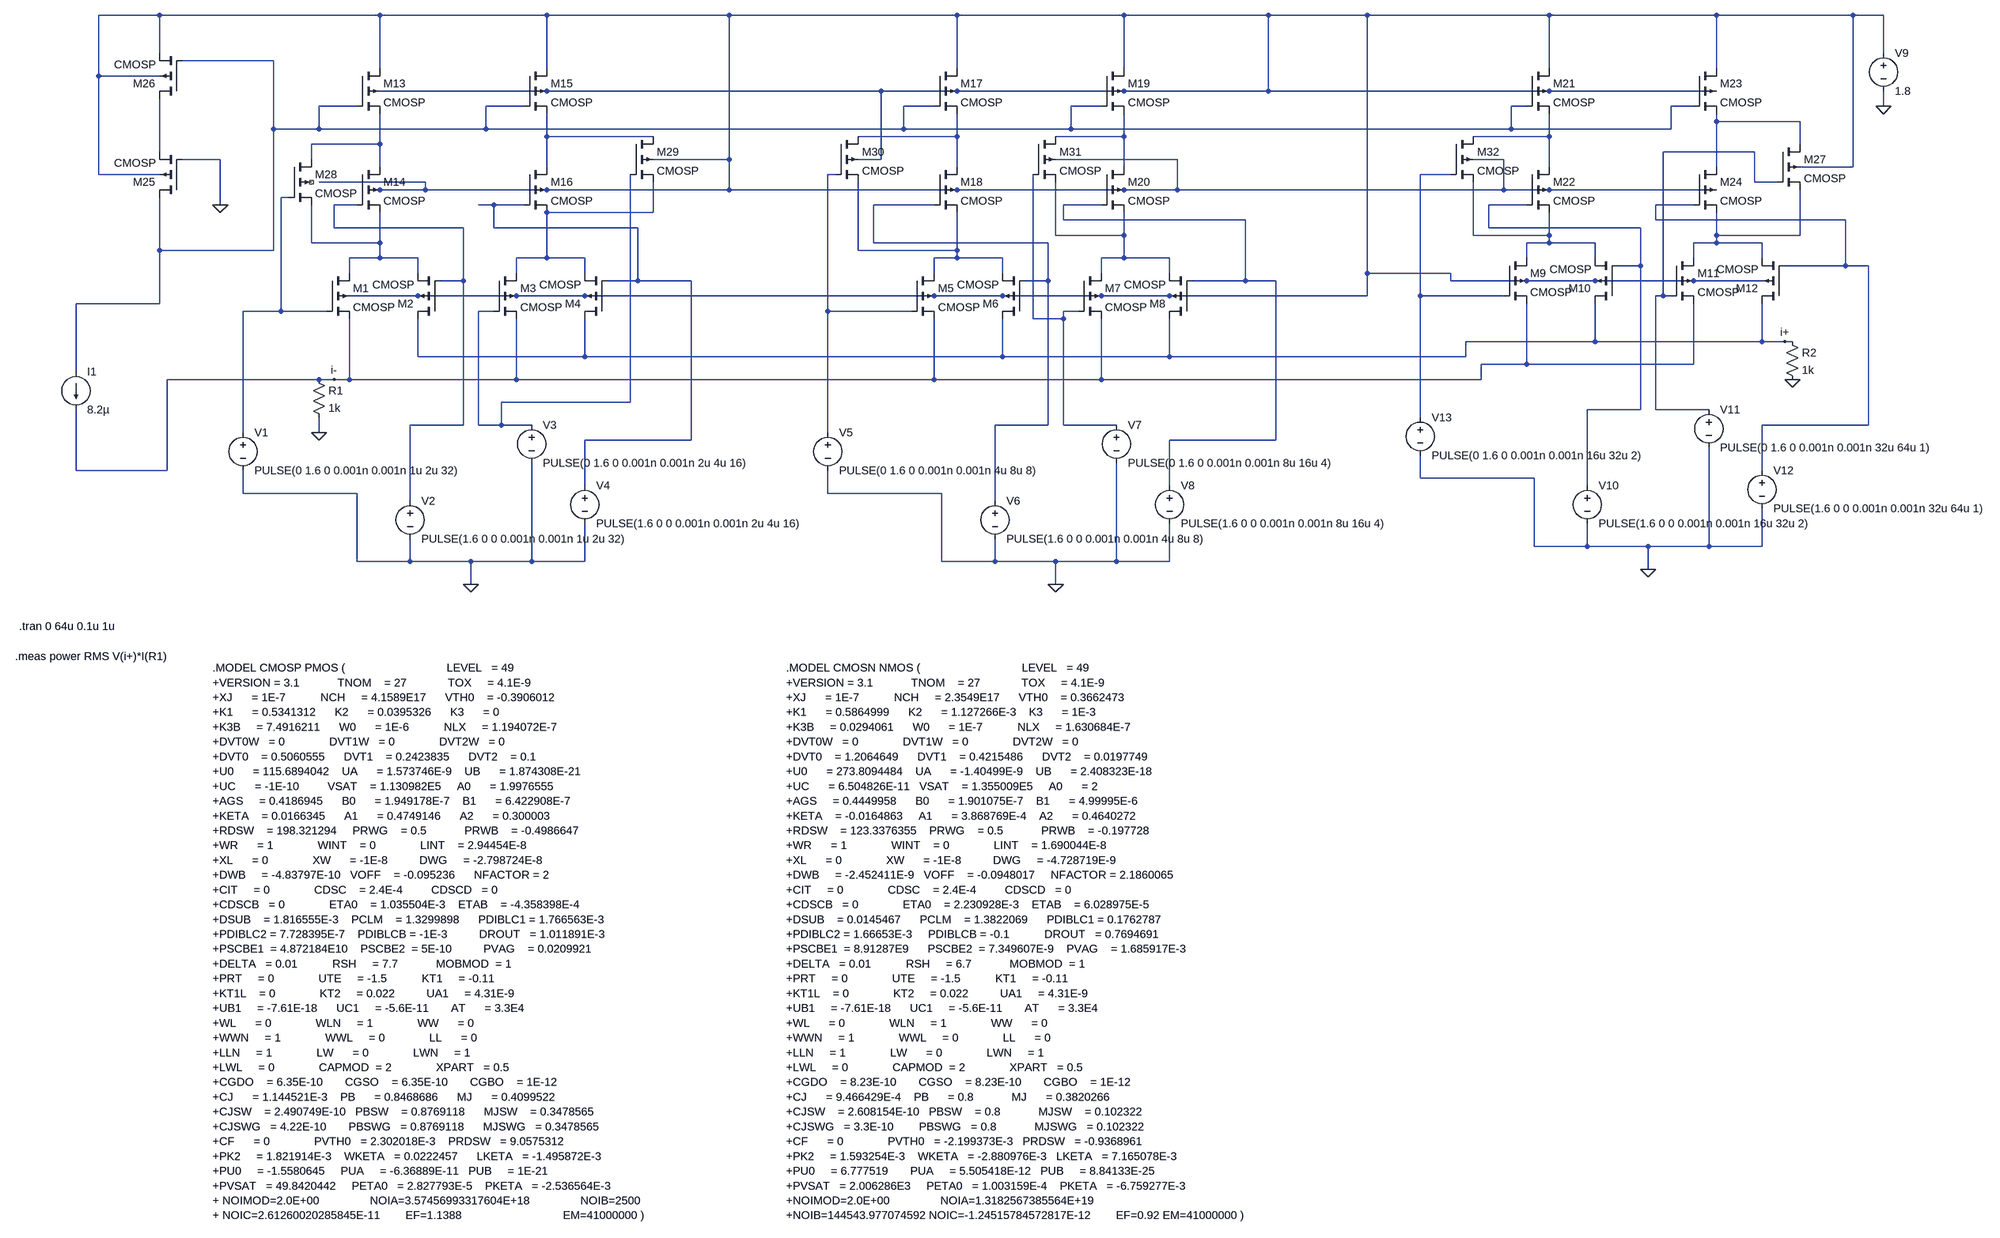
[diagram p0: schematic DAC_pmos.asc]
DAC_pmos.asc, the LTspice schematic file:
Version 4
SHEET 1 3216 2160
WIRE -688 -288 -816 -288
WIRE -224 -288 -688 -288
WIRE 128 -288 -224 -288
WIRE 512 -288 128 -288
WIRE 992 -288 512 -288
WIRE 1344 -288 992 -288
WIRE 1648 -288 1344 -288
WIRE 1856 -288 1648 -288
WIRE 2240 -288 1856 -288
WIRE 2592 -288 2240 -288
WIRE 2880 -288 2592 -288
WIRE 2944 -288 2880 -288
WIRE -688 -208 -688 -288
WIRE 2944 -208 2944 -288
WIRE -448 -192 -640 -192
WIRE -224 -176 -224 -288
WIRE 128 -176 128 -288
WIRE 992 -176 992 -288
WIRE 1344 -176 1344 -288
WIRE 2240 -176 2240 -288
WIRE 2592 -176 2592 -288
WIRE -816 -160 -816 -288
WIRE -688 -160 -816 -160
WIRE 128 -128 -224 -128
WIRE 832 -128 128 -128
WIRE 992 -128 832 -128
WIRE 1344 -128 992 -128
WIRE 1648 -128 1648 -288
WIRE 1648 -128 1344 -128
WIRE 2240 -128 1648 -128
WIRE 2592 -128 2240 -128
WIRE -272 -96 -352 -96
WIRE 80 -96 0 -96
WIRE 944 -96 880 -96
WIRE 1296 -96 1232 -96
WIRE 2192 -96 2160 -96
WIRE 2544 -96 2496 -96
WIRE 2944 -96 2944 -128
WIRE 2592 -64 2592 -80
WIRE 2768 -64 2592 -64
WIRE -448 -48 -448 -192
WIRE -352 -48 -352 -96
WIRE -352 -48 -448 -48
WIRE 0 -48 0 -96
WIRE 0 -48 -352 -48
WIRE 880 -48 880 -96
WIRE 880 -48 0 -48
WIRE 1232 -48 1232 -96
WIRE 1232 -48 880 -48
WIRE 2160 -48 2160 -96
WIRE 2160 -48 1232 -48
WIRE 2496 -48 2496 -96
WIRE 2496 -48 2160 -48
WIRE 128 -32 128 -80
WIRE 352 -32 128 -32
WIRE 992 -32 992 -80
WIRE 992 -32 784 -32
WIRE 1344 -32 1344 -80
WIRE 1344 -32 1200 -32
WIRE 2240 -32 2240 -80
WIRE 2240 -32 2080 -32
WIRE -224 -16 -224 -80
WIRE -224 -16 -368 -16
WIRE 2768 -16 2768 -64
WIRE -688 0 -688 -112
WIRE 2672 0 2480 0
WIRE -560 16 -640 16
WIRE -368 16 -368 -16
WIRE 512 16 512 -288
WIRE 512 16 352 16
WIRE 832 16 832 -128
WIRE 832 16 784 16
WIRE 1456 16 1200 16
WIRE 2144 16 2080 16
WIRE -224 32 -224 -16
WIRE 128 32 128 -32
WIRE 992 32 992 -32
WIRE 1344 32 1344 -32
WIRE 2240 32 2240 -32
WIRE 2592 32 2592 -64
WIRE 2880 32 2880 -288
WIRE 2880 32 2768 32
WIRE -816 48 -816 -160
WIRE -688 48 -816 48
WIRE 736 48 720 48
WIRE 2032 48 1968 48
WIRE -128 64 -352 64
WIRE 2672 64 2672 0
WIRE 2720 64 2672 64
WIRE -224 80 -240 80
WIRE -128 80 -128 64
WIRE -128 80 -224 80
WIRE 128 80 -128 80
WIRE 512 80 512 16
WIRE 512 80 128 80
WIRE 992 80 512 80
WIRE 1344 80 992 80
WIRE 1456 80 1456 16
WIRE 1456 80 1344 80
WIRE 2144 80 2144 16
WIRE 2144 80 1456 80
WIRE 2240 80 2144 80
WIRE 2592 80 2240 80
WIRE -416 96 -432 96
WIRE -560 112 -560 16
WIRE -272 112 -320 112
WIRE 16 112 -16 112
WIRE 80 112 16 112
WIRE 944 112 816 112
WIRE 1296 112 1216 112
WIRE 2192 112 2112 112
WIRE 2544 112 2464 112
WIRE 352 128 352 64
WIRE 352 128 128 128
WIRE 1216 144 1216 112
WIRE 1600 144 1216 144
WIRE 2464 144 2464 112
WIRE 2864 144 2464 144
WIRE -320 160 -320 112
WIRE -48 160 -320 160
WIRE 16 160 16 112
WIRE 320 160 16 160
WIRE 2112 160 2112 112
WIRE 2432 160 2112 160
WIRE 1200 176 1200 64
WIRE 1344 176 1344 128
WIRE 1344 176 1200 176
WIRE 2080 176 2080 64
WIRE 2240 176 2240 128
WIRE 2240 176 2080 176
WIRE 2592 176 2592 128
WIRE 2768 176 2768 80
WIRE 2768 176 2592 176
WIRE -368 192 -368 112
WIRE -224 192 -224 128
WIRE -224 192 -368 192
WIRE 816 192 816 112
WIRE 1184 192 816 192
WIRE 2240 192 2240 176
WIRE 2240 192 2192 192
WIRE 2336 192 2240 192
WIRE 2592 192 2592 176
WIRE 2592 192 2544 192
WIRE 2688 192 2592 192
WIRE -688 208 -688 96
WIRE -448 208 -448 -48
WIRE -448 208 -688 208
WIRE 784 208 784 64
WIRE 992 208 992 128
WIRE 992 208 784 208
WIRE -224 224 -224 192
WIRE -224 224 -288 224
WIRE -144 224 -224 224
WIRE 128 224 128 128
WIRE 128 224 64 224
WIRE 208 224 128 224
WIRE 992 224 992 208
WIRE 992 224 944 224
WIRE 1088 224 992 224
WIRE 1344 224 1344 176
WIRE 1344 224 1296 224
WIRE 1440 224 1344 224
WIRE 2192 224 2192 192
WIRE 2336 224 2336 192
WIRE 2544 224 2544 192
WIRE 2688 224 2688 192
WIRE 2432 240 2432 160
WIRE 2432 240 2384 240
WIRE 2864 240 2864 144
WIRE 2864 240 2736 240
WIRE 2912 240 2864 240
WIRE -288 256 -288 224
WIRE -144 256 -144 224
WIRE 64 256 64 224
WIRE 208 256 208 224
WIRE 944 256 944 224
WIRE 1088 256 1088 224
WIRE 1296 256 1296 224
WIRE 1440 256 1440 224
WIRE 1856 256 1856 -288
WIRE 2032 256 1856 256
WIRE -48 272 -48 160
WIRE -48 272 -96 272
WIRE 320 272 320 160
WIRE 320 272 256 272
WIRE 432 272 320 272
WIRE 1184 272 1184 192
WIRE 1184 272 1136 272
WIRE 1600 272 1600 144
WIRE 1600 272 1488 272
WIRE 1664 272 1600 272
WIRE 2032 272 2032 256
WIRE 2192 272 2032 272
WIRE 2336 272 2192 272
WIRE 2544 272 2336 272
WIRE 2688 272 2544 272
WIRE -144 304 -288 304
WIRE 64 304 -144 304
WIRE 208 304 64 304
WIRE 944 304 208 304
WIRE 1088 304 944 304
WIRE 1296 304 1088 304
WIRE 1440 304 1296 304
WIRE 1856 304 1856 256
WIRE 1856 304 1440 304
WIRE 1968 304 1968 48
WIRE 2144 304 1968 304
WIRE 2480 304 2480 0
WIRE 2480 304 2464 304
WIRE 2496 304 2480 304
WIRE -688 320 -688 208
WIRE -688 320 -864 320
WIRE -432 336 -432 96
WIRE -432 336 -512 336
WIRE -336 336 -432 336
WIRE 16 336 -16 336
WIRE 720 336 720 48
WIRE 896 336 720 336
WIRE 1248 336 1216 336
WIRE 1152 352 1152 48
WIRE 1216 352 1216 336
WIRE 1216 352 1152 352
WIRE 2336 400 2336 320
WIRE 2336 400 2064 400
WIRE 2688 400 2688 320
WIRE 2688 400 2336 400
WIRE 2736 400 2688 400
WIRE 2752 400 2736 400
WIRE -144 432 -144 352
WIRE 208 432 208 352
WIRE 208 432 -144 432
WIRE 1088 432 1088 352
WIRE 1088 432 208 432
WIRE 1440 432 1440 352
WIRE 1440 432 1088 432
WIRE 2064 432 2064 400
WIRE 2064 432 1440 432
WIRE 2192 448 2192 320
WIRE 2192 448 2096 448
WIRE 2544 448 2544 320
WIRE 2544 448 2192 448
WIRE -864 464 -864 320
WIRE -352 480 -672 480
WIRE -320 480 -352 480
WIRE -288 480 -288 352
WIRE -288 480 -320 480
WIRE 64 480 64 352
WIRE 64 480 -288 480
WIRE 944 480 944 352
WIRE 944 480 64 480
WIRE 1296 480 1296 352
WIRE 1296 480 944 480
WIRE 2096 480 2096 448
WIRE 2096 480 1296 480
WIRE 304 528 304 48
WIRE 304 528 32 528
WIRE 2432 544 2432 240
WIRE 2432 544 2320 544
WIRE 2464 544 2464 304
WIRE 2576 544 2464 544
WIRE 1968 560 1968 304
WIRE -48 576 -48 272
WIRE -48 576 -160 576
WIRE -16 576 -16 336
WIRE 32 576 32 528
WIRE 32 576 -16 576
WIRE 96 576 32 576
WIRE 1184 576 1184 272
WIRE 1184 576 1072 576
WIRE 1216 576 1216 352
WIRE 1328 576 1216 576
WIRE 2912 576 2912 240
WIRE 2912 576 2688 576
WIRE -512 592 -512 336
WIRE -352 592 -352 560
WIRE 720 592 720 336
WIRE 432 608 432 272
WIRE 432 608 208 608
WIRE 1664 608 1664 272
WIRE 1664 608 1440 608
WIRE -864 672 -864 544
WIRE -672 672 -672 480
WIRE -672 672 -864 672
WIRE 2688 672 2688 576
WIRE 1968 688 1968 640
WIRE 2208 688 1968 688
WIRE 208 704 208 608
WIRE 1440 704 1440 608
WIRE 2320 704 2320 544
WIRE -512 720 -512 672
WIRE -272 720 -512 720
WIRE 720 720 720 672
WIRE 960 720 720 720
WIRE -160 736 -160 576
WIRE 1072 736 1072 576
WIRE 2208 832 2208 688
WIRE 2320 832 2320 784
WIRE 2320 832 2208 832
WIRE 2448 832 2320 832
WIRE 2576 832 2576 624
WIRE 2576 832 2448 832
WIRE 2688 832 2688 752
WIRE 2688 832 2576 832
WIRE -272 864 -272 720
WIRE -160 864 -160 816
WIRE -160 864 -272 864
WIRE -32 864 -160 864
WIRE 96 864 96 656
WIRE 96 864 -32 864
WIRE 208 864 208 784
WIRE 208 864 96 864
WIRE 960 864 960 720
WIRE 1072 864 1072 816
WIRE 1072 864 960 864
WIRE 1200 864 1072 864
WIRE 1328 864 1328 656
WIRE 1328 864 1200 864
WIRE 1440 864 1440 784
WIRE 1440 864 1328 864
WIRE 2448 880 2448 832
WIRE -32 912 -32 864
WIRE 1200 912 1200 864
FLAG -320 480 i-
FLAG -352 592 0
FLAG -32 912 0
FLAG 1200 912 0
FLAG 2736 400 i+
FLAG 2752 480 0
FLAG 2448 880 0
FLAG 2944 -96 0
FLAG -560 112 0
SYMBOL res -368 464 R0
SYMATTR InstName R1
SYMATTR Value 1k
SYMBOL pmos4 -336 256 R0
SYMATTR InstName M1
SYMATTR Value CMOSP
SYMATTR Value2 l=0.36u w=1.2u m=1
SYMBOL pmos4 -96 352 R180
SYMATTR InstName M2
SYMATTR Value CMOSP
SYMATTR Value2 l=0.36u w=1.2u m=1
SYMBOL pmos4 16 256 R0
SYMATTR InstName M3
SYMATTR Value CMOSP
SYMATTR Value2 l=0.36u w=1.2u m=2
SYMBOL pmos4 256 352 R180
SYMATTR InstName M4
SYMATTR Value CMOSP
SYMATTR Value2 l=0.36u w=1.2u m=2
SYMBOL voltage -512 576 R0
WINDOW 123 0 0 Left 0
WINDOW 39 0 0 Left 0
SYMATTR InstName V1
SYMATTR Value PULSE(0 1.6 0 0.001n 0.001n 1u 2u 32)
SYMBOL voltage -160 720 R0
WINDOW 123 0 0 Left 0
WINDOW 39 0 0 Left 0
SYMATTR InstName V2
SYMATTR Value PULSE(1.6 0 0 0.001n 0.001n 1u 2u 32)
SYMBOL voltage 96 560 R0
WINDOW 123 0 0 Left 0
WINDOW 39 0 0 Left 0
SYMATTR InstName V3
SYMATTR Value PULSE(0 1.6 0 0.001n 0.001n 2u 4u 16)
SYMBOL voltage 208 688 R0
WINDOW 123 0 0 Left 0
WINDOW 39 0 0 Left 0
SYMATTR InstName V4
SYMATTR Value PULSE(1.6 0 0 0.001n 0.001n 2u 4u 16)
SYMBOL pmos4 896 256 R0
SYMATTR InstName M5
SYMATTR Value CMOSP
SYMATTR Value2 l=0.36u w=1.2u m=4
SYMBOL pmos4 1136 352 R180
SYMATTR InstName M6
SYMATTR Value CMOSP
SYMATTR Value2 l=0.36u w=1.2u m=4
SYMBOL pmos4 1248 256 R0
SYMATTR InstName M7
SYMATTR Value CMOSP
SYMATTR Value2 l=0.36u w=1.2u m=8
SYMBOL pmos4 1488 352 R180
SYMATTR InstName M8
SYMATTR Value CMOSP
SYMATTR Value2 l=0.36u w=1.2u m=8
SYMBOL voltage 720 576 R0
WINDOW 123 0 0 Left 0
WINDOW 39 0 0 Left 0
SYMATTR InstName V5
SYMATTR Value PULSE(0 1.6 0 0.001n 0.001n 4u 8u 8)
SYMBOL voltage 1072 720 R0
WINDOW 123 0 0 Left 0
WINDOW 39 0 0 Left 0
SYMATTR InstName V6
SYMATTR Value PULSE(1.6 0 0 0.001n 0.001n 4u 8u 8)
SYMBOL voltage 1328 560 R0
WINDOW 123 0 0 Left 0
WINDOW 39 0 0 Left 0
SYMATTR InstName V7
SYMATTR Value PULSE(0 1.6 0 0.001n 0.001n 8u 16u 4)
SYMBOL voltage 1440 688 R0
WINDOW 123 0 0 Left 0
WINDOW 39 0 0 Left 0
SYMATTR InstName V8
SYMATTR Value PULSE(1.6 0 0 0.001n 0.001n 8u 16u 4)
SYMBOL res 2736 384 R0
SYMATTR InstName R2
SYMATTR Value 1k
SYMBOL pmos4 2144 224 R0
SYMATTR InstName M9
SYMATTR Value CMOSP
SYMATTR Value2 l=0.36u w=1.2u m=16
SYMBOL pmos4 2384 320 R180
SYMATTR InstName M10
SYMATTR Value CMOSP
SYMATTR Value2 l=0.36u w=1.2u m=16
SYMBOL pmos4 2496 224 R0
SYMATTR InstName M11
SYMATTR Value CMOSP
SYMATTR Value2 l=0.36u w=1.2u m=32
SYMBOL pmos4 2736 320 R180
SYMATTR InstName M12
SYMATTR Value CMOSP
SYMATTR Value2 l=0.36u w=1.2u m=32
SYMBOL voltage 2320 688 R0
WINDOW 123 0 0 Left 0
WINDOW 39 0 0 Left 0
SYMATTR InstName V10
SYMATTR Value PULSE(1.6 0 0 0.001n 0.001n 16u 32u 2)
SYMBOL voltage 2576 528 R0
WINDOW 123 0 0 Left 0
WINDOW 39 0 0 Left 0
SYMATTR InstName V11
SYMATTR Value PULSE(0 1.6 0 0.001n 0.001n 32u 64u 1)
SYMBOL voltage 2688 656 R0
WINDOW 123 0 0 Left 0
WINDOW 39 0 0 Left 0
SYMATTR InstName V12
SYMATTR Value PULSE(1.6 0 0 0.001n 0.001n 32u 64u 1)
SYMBOL voltage 1968 544 R0
WINDOW 123 0 0 Left 0
WINDOW 39 0 0 Left 0
SYMATTR InstName V13
SYMATTR Value PULSE(0 1.6 0 0.001n 0.001n 16u 32u 2)
SYMBOL pmos4 -272 -176 R0
SYMATTR InstName M13
SYMATTR Value CMOSP
SYMATTR Value2 l=0.36u w=4u m=1
SYMBOL pmos4 -272 32 R0
SYMATTR InstName M14
SYMATTR Value CMOSP
SYMATTR Value2 l=0.36u w=4u m=1
SYMBOL pmos4 80 -176 R0
SYMATTR InstName M15
SYMATTR Value CMOSP
SYMATTR Value2 l=0.36u w=4u m=2
SYMBOL pmos4 80 32 R0
SYMATTR InstName M16
SYMATTR Value CMOSP
SYMATTR Value2 l=0.36u w=4u m=2
SYMBOL pmos4 944 -176 R0
SYMATTR InstName M17
SYMATTR Value CMOSP
SYMATTR Value2 l=0.36u w=4u m=4
SYMBOL pmos4 944 32 R0
SYMATTR InstName M18
SYMATTR Value CMOSP
SYMATTR Value2 l=0.36u w=4u m=4
SYMBOL pmos4 1296 -176 R0
SYMATTR InstName M19
SYMATTR Value CMOSP
SYMATTR Value2 l=0.36u w=4u m=8
SYMBOL pmos4 1296 32 R0
SYMATTR InstName M20
SYMATTR Value CMOSP
SYMATTR Value2 l=0.36u w=4u m=8
SYMBOL pmos4 2192 -176 R0
SYMATTR InstName M21
SYMATTR Value CMOSP
SYMATTR Value2 l=0.36u w=4u m=16
SYMBOL pmos4 2192 32 R0
SYMATTR InstName M22
SYMATTR Value CMOSP
SYMATTR Value2 l=0.36u w=4u m=16
SYMBOL pmos4 2544 -176 R0
SYMATTR InstName M23
SYMATTR Value CMOSP
SYMATTR Value2 l=0.36u w=4u m=32
SYMBOL pmos4 2544 32 R0
SYMATTR InstName M24
SYMATTR Value CMOSP
SYMATTR Value2 l=0.36u w=4u m=32
SYMBOL pmos4 -640 96 R180
SYMATTR InstName M25
SYMATTR Value CMOSP
SYMATTR Value2 l=0.36u w=4u m=1
SYMBOL pmos4 -640 -112 R180
SYMATTR InstName M26
SYMATTR Value CMOSP
SYMATTR Value2 l=0.36u w=4u m=1
SYMBOL voltage 2944 -224 R0
WINDOW 123 0 0 Left 0
WINDOW 39 0 0 Left 0
SYMATTR InstName V9
SYMATTR Value 1.8
SYMBOL current -864 464 R0
WINDOW 123 0 0 Left 0
WINDOW 39 0 0 Left 0
SYMATTR InstName I1
SYMATTR Value 8.2µ
SYMBOL pmos4 2720 -16 R0
SYMATTR InstName M27
SYMATTR Value CMOSP
SYMATTR Value2 l=0.36u w=4u m=32
SYMBOL pmos4 -416 16 R0
SYMATTR InstName M28
SYMATTR Value CMOSP
SYMATTR Value2 l=0.36u w=4u m=1
SYMBOL pmos4 304 -32 R0
SYMATTR InstName M29
SYMATTR Value CMOSP
SYMATTR Value2 l=0.36u w=4u m=2
SYMBOL pmos4 736 -32 R0
SYMATTR InstName M30
SYMATTR Value CMOSP
SYMATTR Value2 l=0.36u w=4u m=4
SYMBOL pmos4 1152 -32 R0
SYMATTR InstName M31
SYMATTR Value CMOSP
SYMATTR Value2 l=0.36u w=4u m=8
SYMBOL pmos4 2032 -32 R0
SYMATTR InstName M32
SYMATTR Value CMOSP
SYMATTR Value2 l=0.36u w=4u m=16
TEXT 632 1088 Left 2 !.MODEL CMOSN NMOS (                                LEVEL   = 49\n+VERSION = 3.1            TNOM    = 27             TOX     = 4.1E-9\n+XJ      = 1E-7           NCH     = 2.3549E17      VTH0    = 0.3662473\n+K1      = 0.5864999      K2      = 1.127266E-3    K3      = 1E-3\n+K3B     = 0.0294061      W0      = 1E-7           NLX     = 1.630684E-7\n+DVT0W   = 0              DVT1W   = 0              DVT2W   = 0\n+DVT0    = 1.2064649      DVT1    = 0.4215486      DVT2    = 0.0197749\n+U0      = 273.8094484    UA      = -1.40499E-9    UB      = 2.408323E-18\n+UC      = 6.504826E-11   VSAT    = 1.355009E5     A0      = 2\n+AGS     = 0.4449958      B0      = 1.901075E-7    B1      = 4.99995E-6\n+KETA    = -0.0164863     A1      = 3.868769E-4    A2      = 0.4640272\n+RDSW    = 123.3376355    PRWG    = 0.5            PRWB    = -0.197728\n+WR      = 1              WINT    = 0              LINT    = 1.690044E-8\n+XL      = 0              XW      = -1E-8          DWG     = -4.728719E-9\n+DWB     = -2.452411E-9   VOFF    = -0.0948017     NFACTOR = 2.1860065\n+CIT     = 0              CDSC    = 2.4E-4         CDSCD   = 0\n+CDSCB   = 0              ETA0    = 2.230928E-3    ETAB    = 6.028975E-5\n+DSUB    = 0.0145467      PCLM    = 1.3822069      PDIBLC1 = 0.1762787\n+PDIBLC2 = 1.66653E-3     PDIBLCB = -0.1           DROUT   = 0.7694691\n+PSCBE1  = 8.91287E9      PSCBE2  = 7.349607E-9    PVAG    = 1.685917E-3\n+DELTA   = 0.01           RSH     = 6.7            MOBMOD  = 1\n+PRT     = 0              UTE     = -1.5           KT1     = -0.11\n+KT1L    = 0              KT2     = 0.022          UA1     = 4.31E-9\n+UB1     = -7.61E-18      UC1     = -5.6E-11       AT      = 3.3E4\n+WL      = 0              WLN     = 1              WW      = 0\n+WWN     = 1              WWL     = 0              LL      = 0\n+LLN     = 1              LW      = 0              LWN     = 1\n+LWL     = 0              CAPMOD  = 2              XPART   = 0.5\n+CGDO    = 8.23E-10       CGSO    = 8.23E-10       CGBO    = 1E-12\n+CJ      = 9.466429E-4    PB      = 0.8            MJ      = 0.3820266\n+CJSW    = 2.608154E-10   PBSW    = 0.8            MJSW    = 0.102322\n+CJSWG   = 3.3E-10        PBSWG   = 0.8            MJSWG   = 0.102322\n+CF      = 0              PVTH0   = -2.199373E-3   PRDSW   = -0.9368961\n+PK2     = 1.593254E-3    WKETA   = -2.880976E-3   LKETA   = 7.165078E-3\n+PU0     = 6.777519       PUA     = 5.505418E-12   PUB     = 8.84133E-25\n+PVSAT   = 2.006286E3     PETA0   = 1.003159E-4    PKETA   = -6.759277E-3\n+NOIMOD=2.0E+00                NOIA=1.3182567385564E+19\n+NOIB=144543.977074592 NOIC=-1.24515784572817E-12        EF=0.92 EM=41000000 )
TEXT -576 1088 Left 2 !.MODEL CMOSP PMOS (                                LEVEL   = 49\n+VERSION = 3.1            TNOM    = 27             TOX     = 4.1E-9\n+XJ      = 1E-7           NCH     = 4.1589E17      VTH0    = -0.3906012\n+K1      = 0.5341312      K2      = 0.0395326      K3      = 0\n+K3B     = 7.4916211      W0      = 1E-6           NLX     = 1.194072E-7\n+DVT0W   = 0              DVT1W   = 0              DVT2W   = 0\n+DVT0    = 0.5060555      DVT1    = 0.2423835      DVT2    = 0.1\n+U0      = 115.6894042    UA      = 1.573746E-9    UB      = 1.874308E-21\n+UC      = -1E-10         VSAT    = 1.130982E5     A0      = 1.9976555\n+AGS     = 0.4186945      B0      = 1.949178E-7    B1      = 6.422908E-7\n+KETA    = 0.0166345      A1      = 0.4749146      A2      = 0.300003\n+RDSW    = 198.321294     PRWG    = 0.5            PRWB    = -0.4986647\n+WR      = 1              WINT    = 0              LINT    = 2.94454E-8\n+XL      = 0              XW      = -1E-8          DWG     = -2.798724E-8\n+DWB     = -4.83797E-10   VOFF    = -0.095236      NFACTOR = 2\n+CIT     = 0              CDSC    = 2.4E-4         CDSCD   = 0\n+CDSCB   = 0              ETA0    = 1.035504E-3    ETAB    = -4.358398E-4\n+DSUB    = 1.816555E-3    PCLM    = 1.3299898      PDIBLC1 = 1.766563E-3\n+PDIBLC2 = 7.728395E-7    PDIBLCB = -1E-3          DROUT   = 1.011891E-3\n+PSCBE1  = 4.872184E10    PSCBE2  = 5E-10          PVAG    = 0.0209921\n+DELTA   = 0.01           RSH     = 7.7            MOBMOD  = 1\n+PRT     = 0              UTE     = -1.5           KT1     = -0.11\n+KT1L    = 0              KT2     = 0.022          UA1     = 4.31E-9\n+UB1     = -7.61E-18      UC1     = -5.6E-11       AT      = 3.3E4\n+WL      = 0              WLN     = 1              WW      = 0\n+WWN     = 1              WWL     = 0              LL      = 0\n+LLN     = 1              LW      = 0              LWN     = 1\n+LWL     = 0              CAPMOD  = 2              XPART   = 0.5\n+CGDO    = 6.35E-10       CGSO    = 6.35E-10       CGBO    = 1E-12\n+CJ      = 1.144521E-3    PB      = 0.8468686      MJ      = 0.4099522\n+CJSW    = 2.490749E-10   PBSW    = 0.8769118      MJSW    = 0.3478565\n+CJSWG   = 4.22E-10       PBSWG   = 0.8769118      MJSWG   = 0.3478565\n+CF      = 0              PVTH0   = 2.302018E-3    PRDSW   = 9.0575312\n+PK2     = 1.821914E-3    WKETA   = 0.0222457      LKETA   = -1.495872E-3\n+PU0     = -1.5580645     PUA     = -6.36889E-11   PUB     = 1E-21\n+PVSAT   = 49.8420442     PETA0   = 2.827793E-5    PKETA   = -2.536564E-3 \n+ NOIMOD=2.0E+00                NOIA=3.57456993317604E+18                NOIB=2500\n+ NOIC=2.61260020285845E-11        EF=1.1388                                EM=41000000 )
TEXT -984 1000 Left 2 !.tran 0 64u 0.1u 1u
TEXT -992 1064 Left 2 !.meas power RMS V(i+)*I(R1)

The netlist it stands for:
* DAC_pmos.asc
R1 i- 0 1k
M1 N024 N013 i- N001 CMOSP l=0.36u w=1.2u m=1
M2 i+ N014 N024 N001 CMOSP l=0.36u w=1.2u m=1
M3 N020 N026 i- N001 CMOSP l=0.36u w=1.2u m=2
M4 i+ N015 N020 N001 CMOSP l=0.36u w=1.2u m=2
V1 N013 0 PULSE(0 1.6 0 0.001n 0.001n 1u 2u 32)
V2 N014 0 PULSE(1.6 0 0 0.001n 0.001n 1u 2u 32)
V3 N026 0 PULSE(0 1.6 0 0.001n 0.001n 2u 4u 16)
V4 N015 0 PULSE(1.6 0 0 0.001n 0.001n 2u 4u 16)
M5 N025 N011 i- N001 CMOSP l=0.36u w=1.2u m=4
M6 i+ N016 N025 N001 CMOSP l=0.36u w=1.2u m=4
M7 N021 N027 i- N001 CMOSP l=0.36u w=1.2u m=8
M8 i+ N017 N021 N001 CMOSP l=0.36u w=1.2u m=8
V5 N011 0 PULSE(0 1.6 0 0.001n 0.001n 4u 8u 8)
V6 N016 0 PULSE(1.6 0 0 0.001n 0.001n 4u 8u 8)
V7 N027 0 PULSE(0 1.6 0 0.001n 0.001n 8u 16u 4)
V8 N017 0 PULSE(1.6 0 0 0.001n 0.001n 8u 16u 4)
R2 i+ 0 1k
M9 N022 N012 i- N001 CMOSP l=0.36u w=1.2u m=16
M10 i+ N018 N022 N001 CMOSP l=0.36u w=1.2u m=16
M11 N023 N010 i- N001 CMOSP l=0.36u w=1.2u m=32
M12 i+ N019 N023 N001 CMOSP l=0.36u w=1.2u m=32
V10 N018 0 PULSE(1.6 0 0 0.001n 0.001n 16u 32u 2)
V11 N010 0 PULSE(0 1.6 0 0.001n 0.001n 32u 64u 1)
V12 N019 0 PULSE(1.6 0 0 0.001n 0.001n 32u 64u 1)
V13 N012 0 PULSE(0 1.6 0 0.001n 0.001n 16u 32u 2)
M13 N001 N002 N008 N001 CMOSP l=0.36u w=4u m=1
M14 N008 N014 N024 N001 CMOSP l=0.36u w=4u m=1
M15 N001 N002 N004 N001 CMOSP l=0.36u w=4u m=2
M16 N004 N015 N020 N001 CMOSP l=0.36u w=4u m=2
M17 N001 N002 N005 N001 CMOSP l=0.36u w=4u m=4
M18 N005 N016 N025 N001 CMOSP l=0.36u w=4u m=4
M19 N001 N002 N006 N001 CMOSP l=0.36u w=4u m=8
M20 N006 N017 N021 N001 CMOSP l=0.36u w=4u m=8
M21 N001 N002 N007 N001 CMOSP l=0.36u w=4u m=16
M22 N007 N018 N022 N001 CMOSP l=0.36u w=4u m=16
M23 N001 N002 N003 N001 CMOSP l=0.36u w=4u m=32
M24 N003 N019 N023 N001 CMOSP l=0.36u w=4u m=32
M25 N002 0 N009 N001 CMOSP l=0.36u w=4u m=1
M26 N009 N002 N001 N001 CMOSP l=0.36u w=4u m=1
V9 N001 0 1.8
I1 N002 i- 8.2µ
M27 N003 N010 N023 N001 CMOSP l=0.36u w=4u m=32
M28 N008 N013 N024 NC_01 CMOSP l=0.36u w=4u m=1
M29 N004 N026 N020 N001 CMOSP l=0.36u w=4u m=2
M30 N005 N011 N025 N001 CMOSP l=0.36u w=4u m=4
M31 N006 N027 N021 N001 CMOSP l=0.36u w=4u m=8
M32 N007 N012 N022 N001 CMOSP l=0.36u w=4u m=16
.model NMOS NMOS
.model PMOS PMOS
.lib standard.mos
.MODEL CMOSN NMOS (                                LEVEL   = 49
+VERSION = 3.1            TNOM    = 27             TOX     = 4.1E-9
+XJ      = 1E-7           NCH     = 2.3549E17      VTH0    = 0.3662473
+K1      = 0.5864999      K2      = 1.127266E-3    K3      = 1E-3
+K3B     = 0.0294061      W0      = 1E-7           NLX     = 1.630684E-7
+DVT0W   = 0              DVT1W   = 0              DVT2W   = 0
+DVT0    = 1.2064649      DVT1    = 0.4215486      DVT2    = 0.0197749
+U0      = 273.8094484    UA      = -1.40499E-9    UB      = 2.408323E-18
+UC      = 6.504826E-11   VSAT    = 1.355009E5     A0      = 2
+AGS     = 0.4449958      B0      = 1.901075E-7    B1      = 4.99995E-6
+KETA    = -0.0164863     A1      = 3.868769E-4    A2      = 0.4640272
+RDSW    = 123.3376355    PRWG    = 0.5            PRWB    = -0.197728
+WR      = 1              WINT    = 0              LINT    = 1.690044E-8
+XL      = 0              XW      = -1E-8          DWG     = -4.728719E-9
+DWB     = -2.452411E-9   VOFF    = -0.0948017     NFACTOR = 2.1860065
+CIT     = 0              CDSC    = 2.4E-4         CDSCD   = 0
+CDSCB   = 0              ETA0    = 2.230928E-3    ETAB    = 6.028975E-5
+DSUB    = 0.0145467      PCLM    = 1.3822069      PDIBLC1 = 0.1762787
+PDIBLC2 = 1.66653E-3     PDIBLCB = -0.1           DROUT   = 0.7694691
+PSCBE1  = 8.91287E9      PSCBE2  = 7.349607E-9    PVAG    = 1.685917E-3
+DELTA   = 0.01           RSH     = 6.7            MOBMOD  = 1
+PRT     = 0              UTE     = -1.5           KT1     = -0.11
+KT1L    = 0              KT2     = 0.022          UA1     = 4.31E-9
+UB1     = -7.61E-18      UC1     = -5.6E-11       AT      = 3.3E4
+WL      = 0              WLN     = 1              WW      = 0
+WWN     = 1              WWL     = 0              LL      = 0
+LLN     = 1              LW      = 0              LWN     = 1
+LWL     = 0              CAPMOD  = 2              XPART   = 0.5
+CGDO    = 8.23E-10       CGSO    = 8.23E-10       CGBO    = 1E-12
+CJ      = 9.466429E-4    PB      = 0.8            MJ      = 0.3820266
+CJSW    = 2.608154E-10   PBSW    = 0.8            MJSW    = 0.102322
+CJSWG   = 3.3E-10        PBSWG   = 0.8            MJSWG   = 0.102322
+CF      = 0              PVTH0   = -2.199373E-3   PRDSW   = -0.9368961
+PK2     = 1.593254E-3    WKETA   = -2.880976E-3   LKETA   = 7.165078E-3
+PU0     = 6.777519       PUA     = 5.505418E-12   PUB     = 8.84133E-25
+PVSAT   = 2.006286E3     PETA0   = 1.003159E-4    PKETA   = -6.759277E-3
+NOIMOD=2.0E+00                NOIA=1.3182567385564E+19
+NOIB=144543.977074592 NOIC=-1.24515784572817E-12        EF=0.92 EM=41000000 )
.MODEL CMOSP PMOS (                                LEVEL   = 49
+VERSION = 3.1            TNOM    = 27             TOX     = 4.1E-9
+XJ      = 1E-7           NCH     = 4.1589E17      VTH0    = -0.3906012
+K1      = 0.5341312      K2      = 0.0395326      K3      = 0
+K3B     = 7.4916211      W0      = 1E-6           NLX     = 1.194072E-7
+DVT0W   = 0              DVT1W   = 0              DVT2W   = 0
+DVT0    = 0.5060555      DVT1    = 0.2423835      DVT2    = 0.1
+U0      = 115.6894042    UA      = 1.573746E-9    UB      = 1.874308E-21
+UC      = -1E-10         VSAT    = 1.130982E5     A0      = 1.9976555
+AGS     = 0.4186945      B0      = 1.949178E-7    B1      = 6.422908E-7
+KETA    = 0.0166345      A1      = 0.4749146      A2      = 0.300003
+RDSW    = 198.321294     PRWG    = 0.5            PRWB    = -0.4986647
+WR      = 1              WINT    = 0              LINT    = 2.94454E-8
+XL      = 0              XW      = -1E-8          DWG     = -2.798724E-8
+DWB     = -4.83797E-10   VOFF    = -0.095236      NFACTOR = 2
+CIT     = 0              CDSC    = 2.4E-4         CDSCD   = 0
+CDSCB   = 0              ETA0    = 1.035504E-3    ETAB    = -4.358398E-4
+DSUB    = 1.816555E-3    PCLM    = 1.3299898      PDIBLC1 = 1.766563E-3
+PDIBLC2 = 7.728395E-7    PDIBLCB = -1E-3          DROUT   = 1.011891E-3
+PSCBE1  = 4.872184E10    PSCBE2  = 5E-10          PVAG    = 0.0209921
+DELTA   = 0.01           RSH     = 7.7            MOBMOD  = 1
+PRT     = 0              UTE     = -1.5           KT1     = -0.11
+KT1L    = 0              KT2     = 0.022          UA1     = 4.31E-9
+UB1     = -7.61E-18      UC1     = -5.6E-11       AT      = 3.3E4
+WL      = 0              WLN     = 1              WW      = 0
+WWN     = 1              WWL     = 0              LL      = 0
+LLN     = 1              LW      = 0              LWN     = 1
+LWL     = 0              CAPMOD  = 2              XPART   = 0.5
+CGDO    = 6.35E-10       CGSO    = 6.35E-10       CGBO    = 1E-12
+CJ      = 1.144521E-3    PB      = 0.8468686      MJ      = 0.4099522
+CJSW    = 2.490749E-10   PBSW    = 0.8769118      MJSW    = 0.3478565
+CJSWG   = 4.22E-10       PBSWG   = 0.8769118      MJSWG   = 0.3478565
+CF      = 0              PVTH0   = 2.302018E-3    PRDSW   = 9.0575312
+PK2     = 1.821914E-3    WKETA   = 0.0222457      LKETA   = -1.495872E-3
+PU0     = -1.5580645     PUA     = -6.36889E-11   PUB     = 1E-21
+PVSAT   = 49.8420442     PETA0   = 2.827793E-5    PKETA   = -2.536564E-3
+ NOIMOD=2.0E+00                NOIA=3.57456993317604E+18                NOIB=2500
+ NOIC=2.61260020285845E-11        EF=1.1388                                EM=41000000 )
.tran 0 64u 0.1u 1u
.meas power RMS V(i+)*I(R1)
.backanno
.end